# EAGLE schematic BLE_POV_Display_v2.1 (EAGLE 9.6.2)
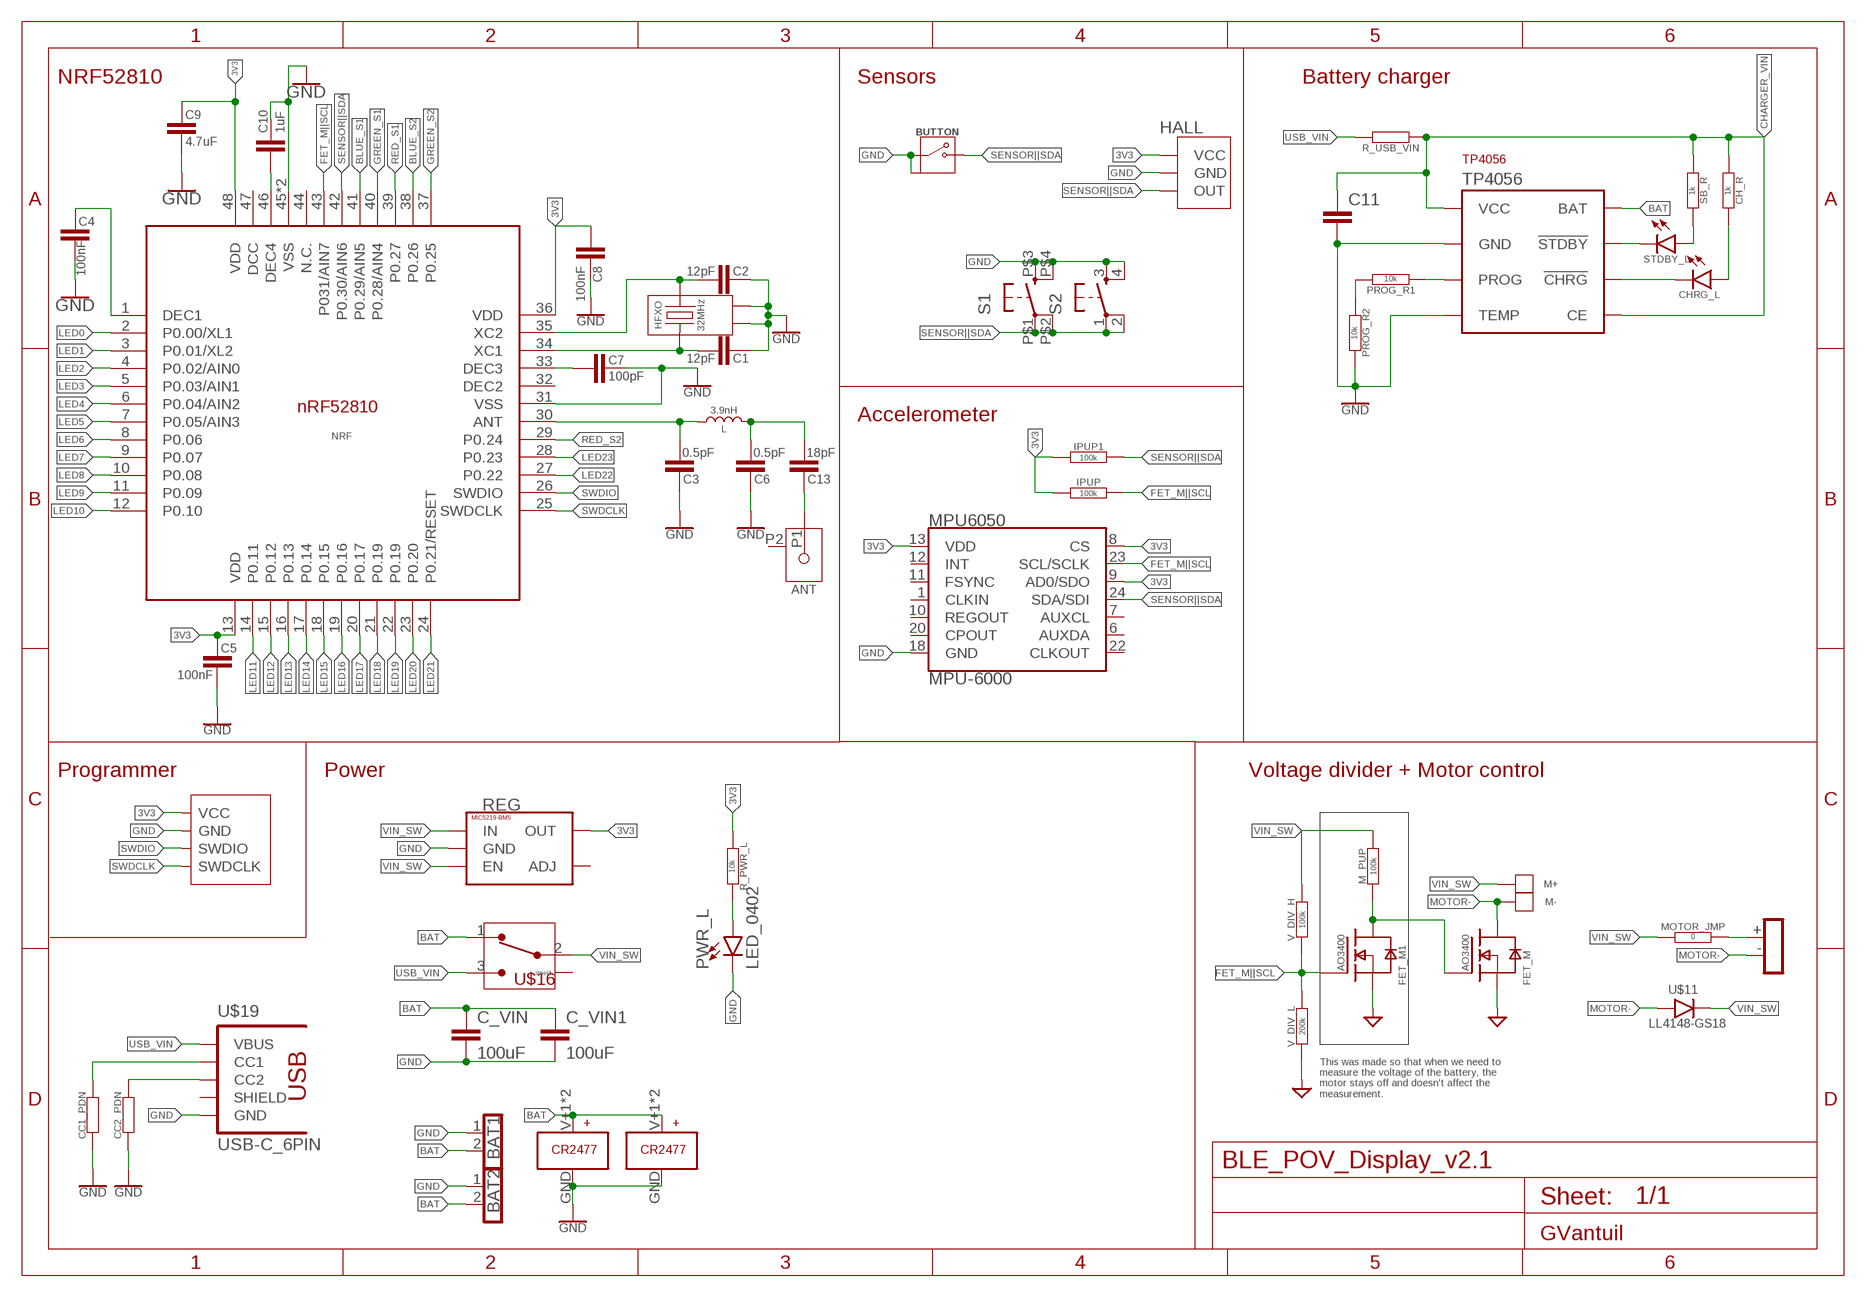
[diagram p0: schematic, sheet 1, part 1 of 2]
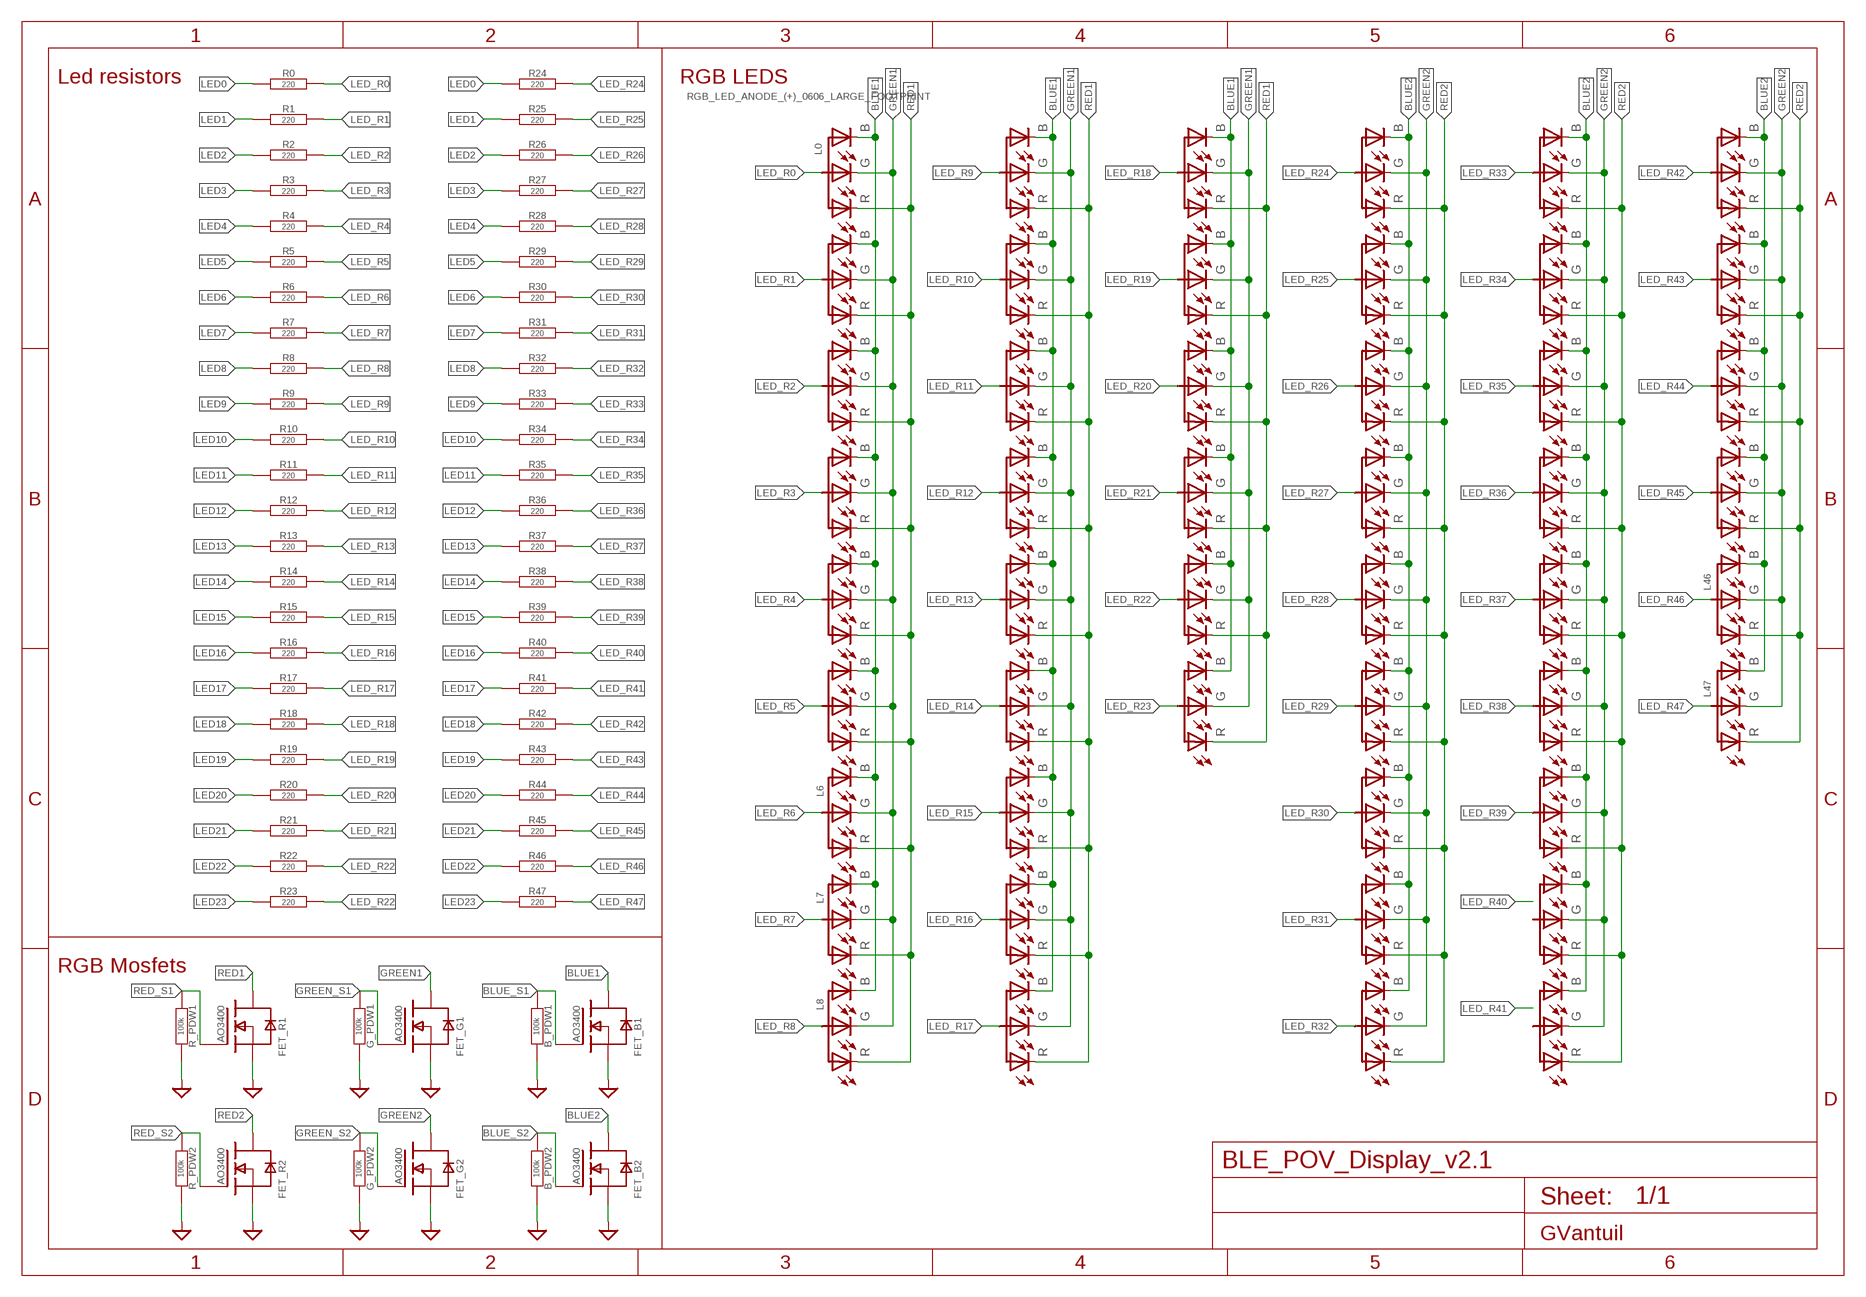
[diagram p1: schematic, sheet 1, part 2 of 2]

## Parts
1  CR2477  [CR2477_PTH]
ANT  ANT3216LL00R2400A  [ANT3216LL00R2400A]
B_PDW1  100k  RESISTOR0402-RES  [0402-RES]
B_PDW2  100k  RESISTOR0402-RES  [0402-RES]
BAT1  PINH1X02  [1X02]
BAT2  PINH1X02  [1X02]
BUTTON  PUSHBUTTON_2X4X3.5  [2X4X3.5MM]
C1  12pF  CAP_0402-CAP  [0402-CAP]
C2  12pF  CAP_0402-CAP  [0402-CAP]
C3  0.5pF  CAP_0402-CAP  [0402-CAP]
C4  100nF  CAP_0402-CAP  [0402-CAP]
C5  100nF  CAP_0402-CAP  [0402-CAP]
C6  0.5pF  CAP_0402-CAP  [0402-CAP]
C7  100pF  CAP_0402-CAP  [0402-CAP]
C8  100nF  CAP_0402-CAP  [0402-CAP]
C9  4.7uF  CAP_1206  [1206]
C10  1uF  CAP_0402-CAP  [0402-CAP]
C11  CAP0603|1206  [0603|1206]
C13  18pF  CAP_0402-CAP  [0402-CAP]
C_VIN  100uF  CAP_1206  [1206]
C_VIN1  100uF  CAP_1206  [1206]
CC1_PDN  RESISTOR0603-RES  [0603-RES]
CC2_PDN  RESISTOR0603-RES  [0603-RES]
CH_R  1k  RESISTOR0402-RES  [0402-RES]
CHRG_L  LED_0402  [0402]
FET_B1  AO3400  [SOT23-3]
FET_B2  AO3400  [SOT23-3]
FET_G1  AO3400  [SOT23-3]
FET_G2  AO3400  [SOT23-3]
FET_M  AO3400  [SOT23-3]
FET_M1  AO3400  [SOT23-3]
FET_R1  AO3400  [SOT23-3]
FET_R2  AO3400  [SOT23-3]
G_PDW1  100k  RESISTOR0402-RES  [0402-RES]
G_PDW2  100k  RESISTOR0402-RES  [0402-RES]
HALL  49E  [TO92_HALLSENSOR]
HFXO  32MHz  XTAL_CX2016DB16000D0WZRC1  [XTAL_CX2016DB16000D0WZRC1]
IPUP  100k  RESISTOR0402-RES  [0402-RES]
IPUP1  100k  RESISTOR0402-RES  [0402-RES]
L  3.9nH  IND_0402  [0402]
L0  RGB_LED_ANODE_(+)_0606_LARGE_FOOTPRINT  [0606]
L1  RGB_LED_ANODE_(+)_0606_LARGE_FOOTPRINT  [0606]
L2  RGB_LED_ANODE_(+)_0606_LARGE_FOOTPRINT  [0606]
L3  RGB_LED_ANODE_(+)_0606_LARGE_FOOTPRINT  [0606]
L4  RGB_LED_ANODE_(+)_0606_LARGE_FOOTPRINT  [0606]
L5  RGB_LED_ANODE_(+)_0606_LARGE_FOOTPRINT  [0606]
L6  RGB_LED_ANODE_(+)_0606_LARGE_FOOTPRINT  [0606]
L7  RGB_LED_ANODE_(+)_0606_LARGE_FOOTPRINT  [0606]
L8  RGB_LED_ANODE_(+)_0606_LARGE_FOOTPRINT  [0606]
L9  RGB_LED_ANODE_(+)_0606_LARGE_FOOTPRINT  [0606]
L10  RGB_LED_ANODE_(+)_0606_LARGE_FOOTPRINT  [0606]
L11  RGB_LED_ANODE_(+)_0606_LARGE_FOOTPRINT  [0606]
L12  RGB_LED_ANODE_(+)_0606_LARGE_FOOTPRINT  [0606]
L13  RGB_LED_ANODE_(+)_0606_LARGE_FOOTPRINT  [0606]
L14  RGB_LED_ANODE_(+)_0606_LARGE_FOOTPRINT  [0606]
L15  RGB_LED_ANODE_(+)_0606_LARGE_FOOTPRINT  [0606]
L16  RGB_LED_ANODE_(+)_0606_LARGE_FOOTPRINT  [0606]
L17  RGB_LED_ANODE_(+)_0606_LARGE_FOOTPRINT  [0606]
L18  RGB_LED_ANODE_(+)_0606_LARGE_FOOTPRINT  [0606]
L19  RGB_LED_ANODE_(+)_0606_LARGE_FOOTPRINT  [0606]
L20  RGB_LED_ANODE_(+)_0606_LARGE_FOOTPRINT  [0606]
L21  RGB_LED_ANODE_(+)_0606_LARGE_FOOTPRINT  [0606]
L22  RGB_LED_ANODE_(+)_0606_LARGE_FOOTPRINT  [0606]
L23  RGB_LED_ANODE_(+)_0606_LARGE_FOOTPRINT  [0606]
L24  RGB_LED_ANODE_(+)_0606_LARGE_FOOTPRINT  [0606]
L25  RGB_LED_ANODE_(+)_0606_LARGE_FOOTPRINT  [0606]
L26  RGB_LED_ANODE_(+)_0606_LARGE_FOOTPRINT  [0606]
L27  RGB_LED_ANODE_(+)_0606_LARGE_FOOTPRINT  [0606]
L28  RGB_LED_ANODE_(+)_0606_LARGE_FOOTPRINT  [0606]
L29  RGB_LED_ANODE_(+)_0606_LARGE_FOOTPRINT  [0606]
L30  RGB_LED_ANODE_(+)_0606_LARGE_FOOTPRINT  [0606]
L31  RGB_LED_ANODE_(+)_0606_LARGE_FOOTPRINT  [0606]
L32  RGB_LED_ANODE_(+)_0606_LARGE_FOOTPRINT  [0606]
L33  RGB_LED_ANODE_(+)_0606_LARGE_FOOTPRINT  [0606]
L34  RGB_LED_ANODE_(+)_0606_LARGE_FOOTPRINT  [0606]
L35  RGB_LED_ANODE_(+)_0606_LARGE_FOOTPRINT  [0606]
L36  RGB_LED_ANODE_(+)_0606_LARGE_FOOTPRINT  [0606]
L37  RGB_LED_ANODE_(+)_0606_LARGE_FOOTPRINT  [0606]
L38  RGB_LED_ANODE_(+)_0606_LARGE_FOOTPRINT  [0606]
L39  RGB_LED_ANODE_(+)_0606_LARGE_FOOTPRINT  [0606]
L40  RGB_LED_ANODE_(+)_0606_LARGE_FOOTPRINT  [0606]
L41  RGB_LED_ANODE_(+)_0606_LARGE_FOOTPRINT  [0606]
L42  RGB_LED_ANODE_(+)_0606_LARGE_FOOTPRINT  [0606]
L43  RGB_LED_ANODE_(+)_0606_LARGE_FOOTPRINT  [0606]
L44  RGB_LED_ANODE_(+)_0606_LARGE_FOOTPRINT  [0606]
L45  RGB_LED_ANODE_(+)_0606_LARGE_FOOTPRINT  [0606]
L46  RGB_LED_ANODE_(+)_0606_LARGE_FOOTPRINT  [0606]
L47  RGB_LED_ANODE_(+)_0606_LARGE_FOOTPRINT  [0606]
LIR2450  CR2477  [CR2477_PTH]
M+  PAD_50X100MIL  [PAD_50X100MIL]
M-  PAD_50X100MIL  [PAD_50X100MIL]
M_PUP  100k  RESISTOR0402-RES  [0402-RES]
MOTOR_JMP  0  RESISTOR0402-RES  [0402-RES]
MPU6050  MPU-6000  [QFN-24-EP]
NRF  NORDIC_NRF_NRF52810_QF  [NRF52810_QFN40P600X600X90-48_N_3MMTHERMAL]
PROG_R1  10k  RESISTOR0603-RES  [0603-RES]
PROG_R2  10k  RESISTOR0603-RES  [0603-RES]
PWR_L  LED_0402  [0402]
R0  220  RESISTOR0402-RES  [0402-RES]
R1  220  RESISTOR0402-RES  [0402-RES]
R2  220  RESISTOR0402-RES  [0402-RES]
R3  220  RESISTOR0402-RES  [0402-RES]
R4  220  RESISTOR0402-RES  [0402-RES]
R5  220  RESISTOR0402-RES  [0402-RES]
R6  220  RESISTOR0402-RES  [0402-RES]
R7  220  RESISTOR0402-RES  [0402-RES]
R8  220  RESISTOR0402-RES  [0402-RES]
R9  220  RESISTOR0402-RES  [0402-RES]
R10  220  RESISTOR0402-RES  [0402-RES]
R11  220  RESISTOR0402-RES  [0402-RES]
R12  220  RESISTOR0402-RES  [0402-RES]
R13  220  RESISTOR0402-RES  [0402-RES]
R14  220  RESISTOR0402-RES  [0402-RES]
R15  220  RESISTOR0402-RES  [0402-RES]
R16  220  RESISTOR0402-RES  [0402-RES]
R17  220  RESISTOR0402-RES  [0402-RES]
R18  220  RESISTOR0402-RES  [0402-RES]
R19  220  RESISTOR0402-RES  [0402-RES]
R20  220  RESISTOR0402-RES  [0402-RES]
R21  220  RESISTOR0402-RES  [0402-RES]
R22  220  RESISTOR0402-RES  [0402-RES]
R23  220  RESISTOR0402-RES  [0402-RES]
R24  220  RESISTOR0402-RES  [0402-RES]
R25  220  RESISTOR0402-RES  [0402-RES]
R26  220  RESISTOR0402-RES  [0402-RES]
R27  220  RESISTOR0402-RES  [0402-RES]
R28  220  RESISTOR0402-RES  [0402-RES]
R29  220  RESISTOR0402-RES  [0402-RES]
R30  220  RESISTOR0402-RES  [0402-RES]
R31  220  RESISTOR0402-RES  [0402-RES]
R32  220  RESISTOR0402-RES  [0402-RES]
R33  220  RESISTOR0402-RES  [0402-RES]
R34  220  RESISTOR0402-RES  [0402-RES]
R35  220  RESISTOR0402-RES  [0402-RES]
R36  220  RESISTOR0402-RES  [0402-RES]
R37  220  RESISTOR0402-RES  [0402-RES]
R38  220  RESISTOR0402-RES  [0402-RES]
R39  220  RESISTOR0402-RES  [0402-RES]
R40  220  RESISTOR0402-RES  [0402-RES]
R41  220  RESISTOR0402-RES  [0402-RES]
R42  220  RESISTOR0402-RES  [0402-RES]
R43  220  RESISTOR0402-RES  [0402-RES]
R44  220  RESISTOR0402-RES  [0402-RES]
R45  220  RESISTOR0402-RES  [0402-RES]
R46  220  RESISTOR0402-RES  [0402-RES]
R47  220  RESISTOR0402-RES  [0402-RES]
R_PDW1  100k  RESISTOR0402-RES  [0402-RES]
R_PDW2  100k  RESISTOR0402-RES  [0402-RES]
R_PWR_L  10k  RESISTOR0402-RES  [0402-RES]
R_USB_VIN  RESISTOR1206  [1206]
REG  MIC5219-BM5  [SOT23-5]
S1  BT_4_PIN_12X12MM_SMD  [12X12MM_SMD_BT]
S2  BT_4_PINSMD  [DTS-6_SMD]
SB_R  1k  RESISTOR0402-RES  [0402-RES]
STDBY_L  LED_0402  [0402]
TP4056  TP4056_SOP8  [SOP8]
U$2  GV_SWD_4P  [GV_SWD_1.27MM_4P_SEMI_SMD]
U$11  LL4148-GS18  [SOD-80]
U$16  SMD_SWITCH  [SMD_SWITCH]
U$19  USB-C_6PIN  [USCX-06FX-XXMX-01]
U$22  MOTOR-24.5X12.3  [MOTOR-24.5X12.3]
V_DIV_H  100k  RESISTOR0402-RES  [0402-RES]
V_DIV_L  200k  RESISTOR0402-RES  [0402-RES]

## Nets
3V3: C5.1 C8.2 C9.1 HALL.VCC IPUP1.1 IPUP.1 MPU6050.8(CS) MPU6050.9(AD0/SDO) MPU6050.13(VDD) NRF.13(VDD) NRF.36(VDD) NRF.48(VDD) R_PWR_L.1 REG.5(OUT) U$2.VCC
BAT [pwr]: 1.V+1(V+) 1.V+2(V+) BAT1.2 BAT2.2 C_VIN1.1 C_VIN.1 LIR2450.V+1(V+) LIR2450.V+2(V+) TP4056.P$5(BAT) U$16.1
BLUE1: FET_B1.3(D) L0.1(LED_BLUE) L1.1(LED_BLUE) L2.1(LED_BLUE) L3.1(LED_BLUE) L4.1(LED_BLUE) L5.1(LED_BLUE) L6.1(LED_BLUE) L7.1(LED_BLUE) L8.1(LED_BLUE) L9.1(LED_BLUE) L10.1(LED_BLUE) L11.1(LED_BLUE) L12.1(LED_BLUE) L13.1(LED_BLUE) L14.1(LED_BLUE) L15.1(LED_BLUE) L16.1(LED_BLUE) L17.1(LED_BLUE) L18.1(LED_BLUE) L19.1(LED_BLUE) L20.1(LED_BLUE) L21.1(LED_BLUE) L22.1(LED_BLUE) L23.1(LED_BLUE)
BLUE2: FET_B2.3(D) L24.1(LED_BLUE) L25.1(LED_BLUE) L26.1(LED_BLUE) L27.1(LED_BLUE) L28.1(LED_BLUE) L29.1(LED_BLUE) L30.1(LED_BLUE) L31.1(LED_BLUE) L32.1(LED_BLUE) L33.1(LED_BLUE) L34.1(LED_BLUE) L35.1(LED_BLUE) L36.1(LED_BLUE) L37.1(LED_BLUE) L38.1(LED_BLUE) L39.1(LED_BLUE) L40.1(LED_BLUE) L41.1(LED_BLUE) L42.1(LED_BLUE) L43.1(LED_BLUE) L44.1(LED_BLUE) L45.1(LED_BLUE) L46.1(LED_BLUE) L47.1(LED_BLUE)
BLUE_S1: B_PDW1.1 FET_B1.1(G) NRF.41(P0.29/AIN5)
BLUE_S2: B_PDW2.1 FET_B2.1(G) NRF.38(P0.26)
CHARGER_VIN [pwr]: C11.1 C11.P$1 CH_R.1 R_USB_VIN.1 SB_R.1 TP4056.P$4(VCC) TP4056.P$8(CE)
FET_M||SCL: FET_M1.1(G) IPUP.2 MPU6050.23(SCL/SCLK) NRF.43(P031/AIN7) V_DIV_H.2 V_DIV_L.2
GND: 1.GND B_PDW1.2 B_PDW2.2 BAT1.1 BAT2.1 BUTTON.2 BUTTON.GND BUTTON.GND2(GND) C1.1 C2.1 C3.2 C4.2 C5.2 C6.2 C7.1 C8.1 C9.2 C10.1 C11.2 C11.P$2 C_VIN1.2 C_VIN.2 CC1_PDN.1 CC2_PDN.1 FET_B1.2(S) FET_B2.2(S) FET_G1.2(S) FET_G2.2(S) FET_M1.2(S) FET_M.2(S) FET_R1.2(S) FET_R2.2(S) G_PDW1.2 G_PDW2.2 HALL.GND HFXO.2 HFXO.4 LIR2450.GND MPU6050.18(GND) NRF.31(VSS) NRF.45(VSS) NRF.PAD(VSS) PROG_R2.2 PWR_L.C R_PDW1.2 R_PDW2.2 REG.2(GND) S1.P$3 S1.P$4 S2.3 S2.4 TP4056.P$1(TEMP) TP4056.P$3(GND) U$2.GND U$19.GND1(GND) U$19.GND2(GND) V_DIV_L.1
GREEN1: FET_G1.3(D) L0.4(LED_GREEN) L1.4(LED_GREEN) L2.4(LED_GREEN) L3.4(LED_GREEN) L4.4(LED_GREEN) L5.4(LED_GREEN) L6.4(LED_GREEN) L7.4(LED_GREEN) L8.4(LED_GREEN) L9.4(LED_GREEN) L10.4(LED_GREEN) L11.4(LED_GREEN) L12.4(LED_GREEN) L13.4(LED_GREEN) L14.4(LED_GREEN) L15.4(LED_GREEN) L16.4(LED_GREEN) L17.4(LED_GREEN) L18.4(LED_GREEN) L19.4(LED_GREEN) L20.4(LED_GREEN) L21.4(LED_GREEN) L22.4(LED_GREEN) L23.4(LED_GREEN)
GREEN2: FET_G2.3(D) L24.4(LED_GREEN) L25.4(LED_GREEN) L26.4(LED_GREEN) L27.4(LED_GREEN) L28.4(LED_GREEN) L29.4(LED_GREEN) L30.4(LED_GREEN) L31.4(LED_GREEN) L32.4(LED_GREEN) L33.4(LED_GREEN) L34.4(LED_GREEN) L35.4(LED_GREEN) L36.4(LED_GREEN) L37.4(LED_GREEN) L38.4(LED_GREEN) L39.4(LED_GREEN) L40.4(LED_GREEN) L41.4(LED_GREEN) L42.4(LED_GREEN) L43.4(LED_GREEN) L44.4(LED_GREEN) L45.4(LED_GREEN) L46.4(LED_GREEN) L47.4(LED_GREEN)
GREEN_S1: FET_G1.1(G) G_PDW1.1 NRF.40(P0.28/AIN4)
GREEN_S2: FET_G2.1(G) G_PDW2.1 NRF.37(P0.25)
LED0: NRF.2(P0.00/XL1) R0.1 R24.1
LED1: NRF.3(P0.01/XL2) R1.1 R25.1
LED2: NRF.4(P0.02/AIN0) R2.1 R26.1
LED3: NRF.5(P0.03/AIN1) R3.1 R27.1
LED4: NRF.6(P0.04/AIN2) R4.1 R28.1
LED5: NRF.7(P0.05/AIN3) R5.1 R29.1
LED6: NRF.8(P0.06) R6.1 R30.1
LED7: NRF.9(P0.07) R7.1 R31.1
LED8: NRF.10(P0.08) R8.1 R32.1
LED9: NRF.11(P0.09) R9.1 R33.1
LED10: NRF.12(P0.10) R10.1 R34.1
LED11: NRF.14(P0.11) R11.1 R35.1
LED12: NRF.15(P0.12) R12.1 R36.1
LED13: NRF.16(P0.13) R13.1 R37.1
LED14: NRF.17(P0.14) R14.1 R38.1
LED15: NRF.18(P0.15) R15.1 R39.1
LED16: NRF.19(P0.16) R16.1 R40.1
LED17: NRF.20(P0.17) R17.1 R41.1
LED18: NRF.21(P0.19) R18.1 R42.1
LED19: NRF.22(P0.19) R19.1 R43.1
LED20: NRF.23(P0.20) R20.1 R44.1
LED21: NRF.24(P0.21/RESET) R21.1 R45.1
LED22: NRF.27(P0.22) R22.1 R46.1
LED23: NRF.28(P0.23) R23.1 R47.1
LED_R0: L0.2(COMMON_ANODE) R0.2
LED_R1: L1.2(COMMON_ANODE) R1.2
LED_R2: L2.2(COMMON_ANODE) R2.2
LED_R3: L3.2(COMMON_ANODE) R3.2
LED_R4: L4.2(COMMON_ANODE) R4.2
LED_R5: L5.2(COMMON_ANODE) R5.2
LED_R6: L6.2(COMMON_ANODE) R6.2
LED_R7: L7.2(COMMON_ANODE) R7.2
LED_R8: L8.2(COMMON_ANODE) R8.2
LED_R9: L9.2(COMMON_ANODE) R9.2
LED_R10: L10.2(COMMON_ANODE) R10.2
LED_R11: L11.2(COMMON_ANODE) R11.2
LED_R12: L12.2(COMMON_ANODE) R12.2
LED_R13: L13.2(COMMON_ANODE) R13.2
LED_R14: L14.2(COMMON_ANODE) R14.2
LED_R15: L15.2(COMMON_ANODE) R15.2
LED_R16: L16.2(COMMON_ANODE) R16.2
LED_R17: L17.2(COMMON_ANODE) R17.2
LED_R18: L18.2(COMMON_ANODE) R18.2
LED_R19: L19.2(COMMON_ANODE) R19.2
LED_R20: L20.2(COMMON_ANODE) R20.2
LED_R21: L21.2(COMMON_ANODE) R21.2
LED_R22: L22.2(COMMON_ANODE) R22.2 R23.2
LED_R23: L23.2(COMMON_ANODE)
LED_R24: L24.2(COMMON_ANODE) R24.2
LED_R25: L25.2(COMMON_ANODE) R25.2
LED_R26: L26.2(COMMON_ANODE) R26.2
LED_R27: L27.2(COMMON_ANODE) R27.2
LED_R28: L28.2(COMMON_ANODE) R28.2
LED_R29: L29.2(COMMON_ANODE) R29.2
LED_R30: L30.2(COMMON_ANODE) R30.2
LED_R31: L31.2(COMMON_ANODE) R31.2
LED_R32: L32.2(COMMON_ANODE) R32.2
LED_R33: L33.2(COMMON_ANODE) R33.2
LED_R34: L34.2(COMMON_ANODE) R34.2
LED_R35: L35.2(COMMON_ANODE) R35.2
LED_R36: L36.2(COMMON_ANODE) R36.2
LED_R37: L37.2(COMMON_ANODE) R37.2
LED_R38: L38.2(COMMON_ANODE) R38.2
LED_R39: L39.2(COMMON_ANODE) R39.2
LED_R40: R40.2
LED_R41: R41.2
LED_R42: L42.2(COMMON_ANODE) R42.2
LED_R43: L43.2(COMMON_ANODE) R43.2
LED_R44: L44.2(COMMON_ANODE) R44.2
LED_R45: L45.2(COMMON_ANODE) R45.2
LED_R46: L46.2(COMMON_ANODE) R46.2
LED_R47: L47.2(COMMON_ANODE) R47.2
MOTOR- [pwr]: FET_M.3(D) M-.P$1 U$11.+ U$22.-(CW-)
N$1: C1.2 HFXO.3 NRF.34(XC1)
N$2: C2.2 HFXO.1 NRF.35(XC2)
N$3: C7.2 NRF.33(DEC3)
N$4: CC2_PDN.2 U$19.CC2
N$5: PROG_R1.2 PROG_R2.1
N$6: CHRG_L.C TP4056.P$7(!CHRG)
N$7: STDBY_L.C TP4056.P$6(!STDBY)
N$8: C10.2 NRF.46(DEC4)
N$9: CC1_PDN.2 U$19.CC1
N$10: C3.1 L.1 NRF.30(ANT)
N$11: C4.1 NRF.1(DEC1)
N$12: FET_M1.3(D) FET_M.1(G) M_PUP.1
N$13 [pwr]: MOTOR_JMP.1 U$22.+(CW+)
N$14: PROG_R1.1 TP4056.P$2(PROG)
N$16: SB_R.2 STDBY_L.A
N$17: CH_R.2 CHRG_L.A
N$18: C6.1 C13.1 L.2
N$19: ANT.P1 C13.2
N$30: PWR_L.A R_PWR_L.2
RED1: FET_R1.3(D) L0.3(LED_RED) L1.3(LED_RED) L2.3(LED_RED) L3.3(LED_RED) L4.3(LED_RED) L5.3(LED_RED) L6.3(LED_RED) L7.3(LED_RED) L8.3(LED_RED) L9.3(LED_RED) L10.3(LED_RED) L11.3(LED_RED) L12.3(LED_RED) L13.3(LED_RED) L14.3(LED_RED) L15.3(LED_RED) L16.3(LED_RED) L17.3(LED_RED) L18.3(LED_RED) L19.3(LED_RED) L20.3(LED_RED) L21.3(LED_RED) L22.3(LED_RED) L23.3(LED_RED)
RED2: FET_R2.3(D) L24.3(LED_RED) L25.3(LED_RED) L26.3(LED_RED) L27.3(LED_RED) L28.3(LED_RED) L29.3(LED_RED) L30.3(LED_RED) L31.3(LED_RED) L32.3(LED_RED) L33.3(LED_RED) L34.3(LED_RED) L35.3(LED_RED) L36.3(LED_RED) L37.3(LED_RED) L38.3(LED_RED) L39.3(LED_RED) L40.3(LED_RED) L41.3(LED_RED) L42.3(LED_RED) L43.3(LED_RED) L44.3(LED_RED) L45.3(LED_RED) L46.3(LED_RED) L47.3(LED_RED)
RED_S1: FET_R1.1(G) NRF.39(P0.27) R_PDW1.1
RED_S2: FET_R2.1(G) NRF.29(P0.24) R_PDW2.1
SENSOR||SDA: BUTTON.1 HALL.OUT IPUP1.2 MPU6050.24(SDA/SDI) NRF.42(P0.30/AIN6) S1.P$1 S1.P$2 S2.1 S2.2
SWDCLK: NRF.25(SWDCLK) U$2.SWDCLK
SWDIO: NRF.26(SWDIO) U$2.SWDIO
USB_VIN [pwr]: R_USB_VIN.2 U$16.3 U$19.VBUS1(VBUS) U$19.VBUS2(VBUS)
VIN_SW [pwr]: M+.P$1 M_PUP.2 MOTOR_JMP.2 REG.1(IN) REG.3(EN) U$11.- U$16.2 V_DIV_H.1
Unconnected: ANT.P2 L40.2(COMMON_ANODE) L41.2(COMMON_ANODE) MPU6050.1(CLKIN) MPU6050.6(AUXDA) MPU6050.7(AUXCL) MPU6050.10(REGOUT) MPU6050.11(FSYNC) MPU6050.12(INT) MPU6050.20(CPOUT) MPU6050.22(CLKOUT) NRF.32(DEC2) NRF.44(N.C.) NRF.47(DCC) REG.4(ADJ) U$16.GND1 U$16.GND2 U$16.GND3 U$16.GND4

## Notes on the sheet
- NRF52810 | Sensors | Battery charger | Led resistors | RGB LEDS
- Accelerometer
- Programmer | Power | Voltage divider + Motor control
- RGB Mosfets
- This was made so that when we need to
  measure the voltage of the battery, the 
  motor stays off and doesn't affect the 
  measurement.

## Power pins joined to a net without a drawn wire
SHIELD: U$19.SHIELD1(SHIELD) U$19.SHIELD2(SHIELD) U$19.SHIELD3(SHIELD) U$19.SHIELD4(SHIELD)

## Library data of the parts
1 LIR2450 = 0000_GV_batteries:CR2477; BOM: YES; MPN: CR2477_PTH_HOLDER
ANT = 0000_GV_antennas:ANT3216LL00R2400A
B_PDW1 B_PDW2 CC1_PDN CC2_PDN CH_R G_PDW1 G_PDW2 IPUP IPUP1 M_PUP MOTOR_JMP PROG_R1 PROG_R2 R0 R1-R47 R_PDW1 R_PDW2 R_PWR_L R_USB_VIN SB_R V_DIV_H V_DIV_L = 0000_GV_resistors:RESISTOR: Resistor Basic schematic elements and footprints for 0603, 1206, and PTH 1/10th watt (small) resistors.
BAT1 BAT2 = 0000_GV_connectors:PINH1X02
BUTTON = 0000_GV_switches:PUSHBUTTON_2X4X3.5
C1-C10 C13 C_VIN C_VIN1 = 0000_GV_capacitors:CAP_: Capacitor Standard 0603 ceramic capacitor, and 0.1" leaded capacitor.
C11 = 0000_GV_capacitors:CAP: Capacitor Standard 0603 ceramic capacitor, and 0.1" leaded capacitor.
CHRG_L PWR_L STDBY_L = 0000_GV_Leds:LED
FET_B1 FET_B2 FET_G1 FET_G2 FET_M FET_M1 FET_R1 FET_R2 = 0000_GV_transistors:AO3400: Check prices <https://pricing.snapeda.com/parts/AO3400/Alpha%20%26/view-part?ref=eda>
HALL = 0000_GV_sensors:49E
HFXO = 0000_GV_cristal_and _timers:XTAL: Crystal 16MHz 8pF 4-Pin SMD Check availability <https://pricing.snapeda.com/parts/CX2016DB16000D0WZRC1/Kyocera%20AVX/view-part?ref=eda>; AVAILABILITY: In Stock; MF: Kyocera AVX; MP: CX2016DB16000D0WZRC1; PACKAGE: None; PRICE: None; PURCHASE-URL: https://pricing.snapeda.com/search/part/CX2016DB16000D0WZRC1/?ref=eda
L = 0000_GV_inductors:IND
L0 L1-L47 = 0000_GV_Leds:RGB_LED_ANODE_(+)
M+ M- = 0000_GV_connectors:PAD
MPU6050 = 0000_GV_sensors:MPU-6000: Invensense MPU-6000 6-Axis Gryoscope/Accelerometer 3-axis gyroscope, 3-axis accelerometer in a 4x4 package. The MPU-6000 is the world’s first 6-axis I²C MotionTracking device designed for the low power, low cost, and high performance requirements of smartphones, tablets and wearable sensors. Datasheet <http://cdn.sparkfun.com/datasheets/Components/General%20IC/PS-MPU-6000A.pdf> SparkFun Products MPU-6000 - Motion Processing Unit <https://www.sparkfun.com/products/11234> (SEN-11234) SparkFun UDB5 - PIC UAV Development Board <https://www.sparkfun.com/products/11703> (GPS-11703); PROD_ID: IC-11089; SF_ID: SEN-11234
NRF = 0000_GV_MCUs:NORDIC_NRF_NRF52810_QF: nRF52810 Features Single chip, highly flexible, 2.4 GHz multi-protocol SoC 32-bit ARM Cortex-M4 Processor 1.7v to 3.6v operation 192kB flash + 24kB RAM Supports concurrent Bluetooth low energy/ANT protocol operation Up to +4dBm output power -96dBm sensitivity, Bluetooth low energy Thread safe and run-time protected Event driven API On air compatible with nRF24L and nRF24AP series 2 data rates (2Mbps/1Mbps) PPI - maximum flexibility for power-efficient applications and code simplification Automated power management system with automatic power management of each peripheral Configurable I/O mapping for analog and digital I/O 1 x Master/Slave SPI 1 x Two-wire interface (I²C) UART (RTS/CTS) 1 x PWM (4 channels) AES HW encryption 8-channel 10/12-bit ADC Quadrature decoder 64-level analog comparator Real Time Counter (RTC) Digital microphone interface (PDM) On-chip balun Applications Bluetooth 5 connectivity processor Industrial sensors and actuators Wearables SmartHome sensors computer peripherals RF smart remotes Airfuel (A4WP) wireless charging Beacons Sports and fitness sensors Connected health products Smart watches RC Toys Interactive games Building automation
REG = 0000_GV_regulators:MIC5219-BM5
S1 S2 = 0000_GV_switches:BT_4_PIN
TP4056 = 0000_GV_batteries:TP4056: TP4056 Data sheet <http://goo.gl/J7k8TF> Dave.Calaway Eagle Library <https://goo.gl/Muy1Tr>
U$2 = 0000_GV_connectors:GV_SWD_4P
U$11 = 0000_GV_Diodes:LL4148-GS18: Small Signal Fast Switching Diodes; BOM: YES; MPN: LL4148-GS18
U$16 = 0000_GV_switches:SMD_SWITCH
U$19 = 0000_GV_connectors:USB-C: AliExpress Special! Connect 5.1k 10% resistors to each CC pin, pulled up to 3.3v or 5.0v.
U$22 = 0000_GV_motors:MOTOR-24.5X12.3

## Net classes
1 pwr: width 0.203 mm